# EAGLE design schematic (EAGLE 7.7.0)
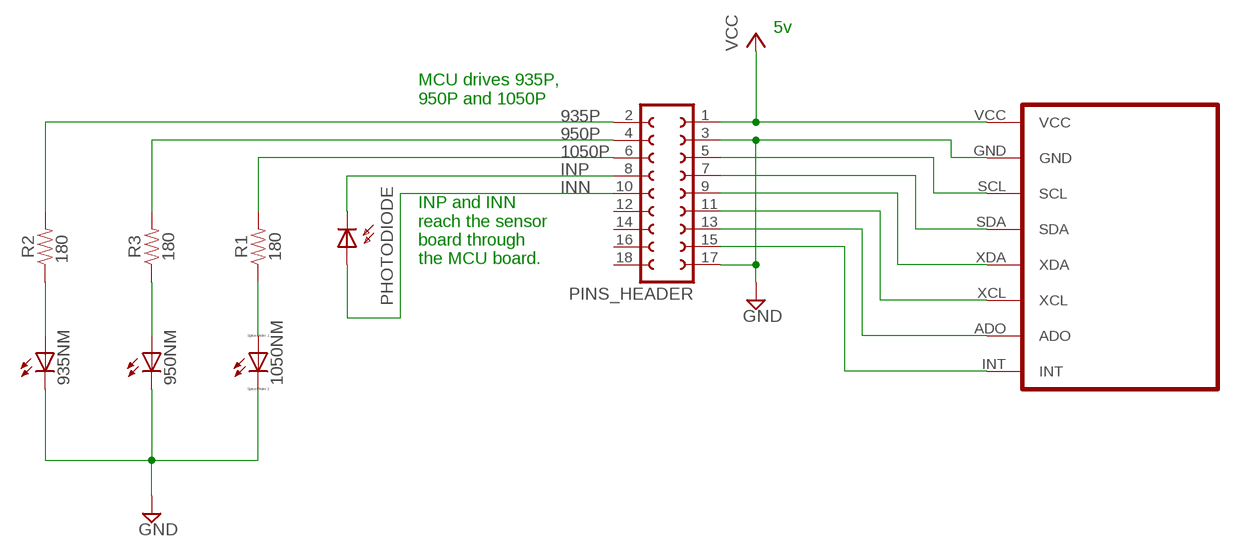
[diagram p0: schematic, sheet 1]

## Parts
935NM  LEDIRL80A  [IRL80A]
950NM  LEDIRL80A  [IRL80A]
1050NM  LED_E  [LED_1206]
PHOTODIODE  SFH206  [SFH206]
PINS_HEADER  FE09-2  [FE09-2]
R1  180  RESISTORAXIAL-0.3  [AXIAL-0.3]
R2  180  RESISTORAXIAL-0.3  [AXIAL-0.3]
R3  180  RESISTORAXIAL-0.3  [AXIAL-0.3]
U1  GY-521MPU6050  [GY-521]

## Nets
935P: PINS_HEADER.2 R2.P$2
950P: PINS_HEADER.4 R3.P$2
1050P: PINS_HEADER.6 R1.P$2
GND: 935NM.K(C) 950NM.K(C) 1050NM.C PINS_HEADER.3 PINS_HEADER.17 U1.GND
INN: PHOTODIODE.A PINS_HEADER.10
INP: PHOTODIODE.K(C) PINS_HEADER.8
N$1: 1050NM.A R1.P$1
N$2: 935NM.A R2.P$1
N$3: 950NM.A R3.P$1
N$6: PINS_HEADER.5 U1.SCL
N$7: PINS_HEADER.7 U1.SDA
N$8: PINS_HEADER.9 U1.XDA
N$9: PINS_HEADER.11 U1.XCL
N$10: PINS_HEADER.13 U1.ADO
N$11: PINS_HEADER.15 U1.INT
VCC: PINS_HEADER.1 U1.VCC
Unconnected: PINS_HEADER.12 PINS_HEADER.14 PINS_HEADER.16 PINS_HEADER.18

## Notes on the sheet
- 5v
- MCU drives 935P,
  950P and 1050P
- INP and INN
  reach the sensor
  board through 
  the MCU board.

## Library data of the parts
935NM 950NM = led:LED: LED OSRAM: - CHIPLED LG R971, LG N971, LY N971, LG Q971, LY Q971, LO R971, LY R971 LH N974, LH R974 LS Q976, LO Q976, LY Q976 LO Q996 - Hyper CHIPLED LW Q18S LB Q993, LB Q99A, LB R99A - SideLED LS A670, LO A670, LY A670, LG A670, LP A670 LB A673, LV A673, LT A673, LW A673 LH A674 LY A675 LS A676, LA A676, LO A676, LY A676, LW A676 LS A679, LY A679, LG A679 - Hyper Micro SIDELED® LS Y876, LA Y876, LO Y876, LY Y876 LT Y87S - SmartLED LW L88C, LW L88S LB L89C, LB L89S, LG L890 LS L89K, LO L89K, LY L89K LS L896, LA L896, LO L896, LY L896 - TOPLED LS T670, LO T670, LY T670, LG T670, LP T670 LSG T670, LSP T670, LSY T670, LOP T670, LYG T670 LG T671, LOG T671, LSG T671 LB T673, LV T673, LT T673, LW T673 LH T674 LS T676, LA T676, LO T676, LY T676, LB T676, LH T676, LSB T676, LW T676 LB T67C, LV T67C, LT T67C, LS T67K, LO T67K, LY T67K, LW E67C LS E67B, LA E67B, LO E67B, LY E67B, LB E67C, LV E67C, LT E67C LW T67C LS T679, LY T679, LG T679 LS T770, LO T770, LY T770, LG T770, LP T770 LB T773, LV T773, LT T773, LW T773 LH T774 LS E675, LA E675, LY E675, LS T675 LS T776, LA T776, LO T776, LY T776, LB T776 LHGB T686 LT T68C, LB T68C - Hyper Mini TOPLED® LB M676 - Mini TOPLED Santana® LG M470 LS M47K, LO M47K, LY M47K Source: http://www.osram.convergy.de LUXEON: - LUMILED® LXK2-PW12-R00, LXK2-PW12-S00, LXK2-PW14-U00, LXK2-PW14-V00 LXK2-PM12-R00, LXK2-PM12-S00, LXK2-PM14-U00 LXK2-PE12-Q00, LXK2-PE12-R00, LXK2-PE12-S00, LXK2-PE14-T00, LXK2-PE14-U00 LXK2-PB12-K00, LXK2-PB12-L00, LXK2-PB12-M00, LXK2-PB14-N00, LXK2-PB14-P00, LXK2-PB14-Q00 LXK2-PR12-L00, LXK2-PR12-M00, LXK2-PR14-Q00, LXK2-PR14-R00 LXK2-PD12-Q00, LXK2-PD12-R00, LXK2-PD12-S00 LXK2-PH12-R00, LXK2-PH12-S00 LXK2-PL12-P00, LXK2-PL12-Q00, LXK2-PL12-R00 Source: www.luxeon.com KINGBRIGHT: KA-3528ASYC Source: www.kingbright.com
1050NM = eagle-ltspice:LED_E: LED Source: http://www.osram.convergy.de Source: www.luxeon.com Source: www.kingbright.com; SPICEMODEL: NONE; SPICEPREFIX: D; SPICETYPE: diode
PHOTODIODE = opto-trans-siemens:SFH206: PHOTO DIODE; MPN: SFH206K; OC_FARNELL: 1212741; OC_NEWARK: 01M8807
PINS_HEADER = con-lsta:FE09-2: FEMALE HEADER; OC_FARNELL: unknown; OC_NEWARK: unknown
R1-R3 = SparkFun-Resistors:RESISTOR: Generic Resistor Package
U1 = gy-521:GY-521

## Board
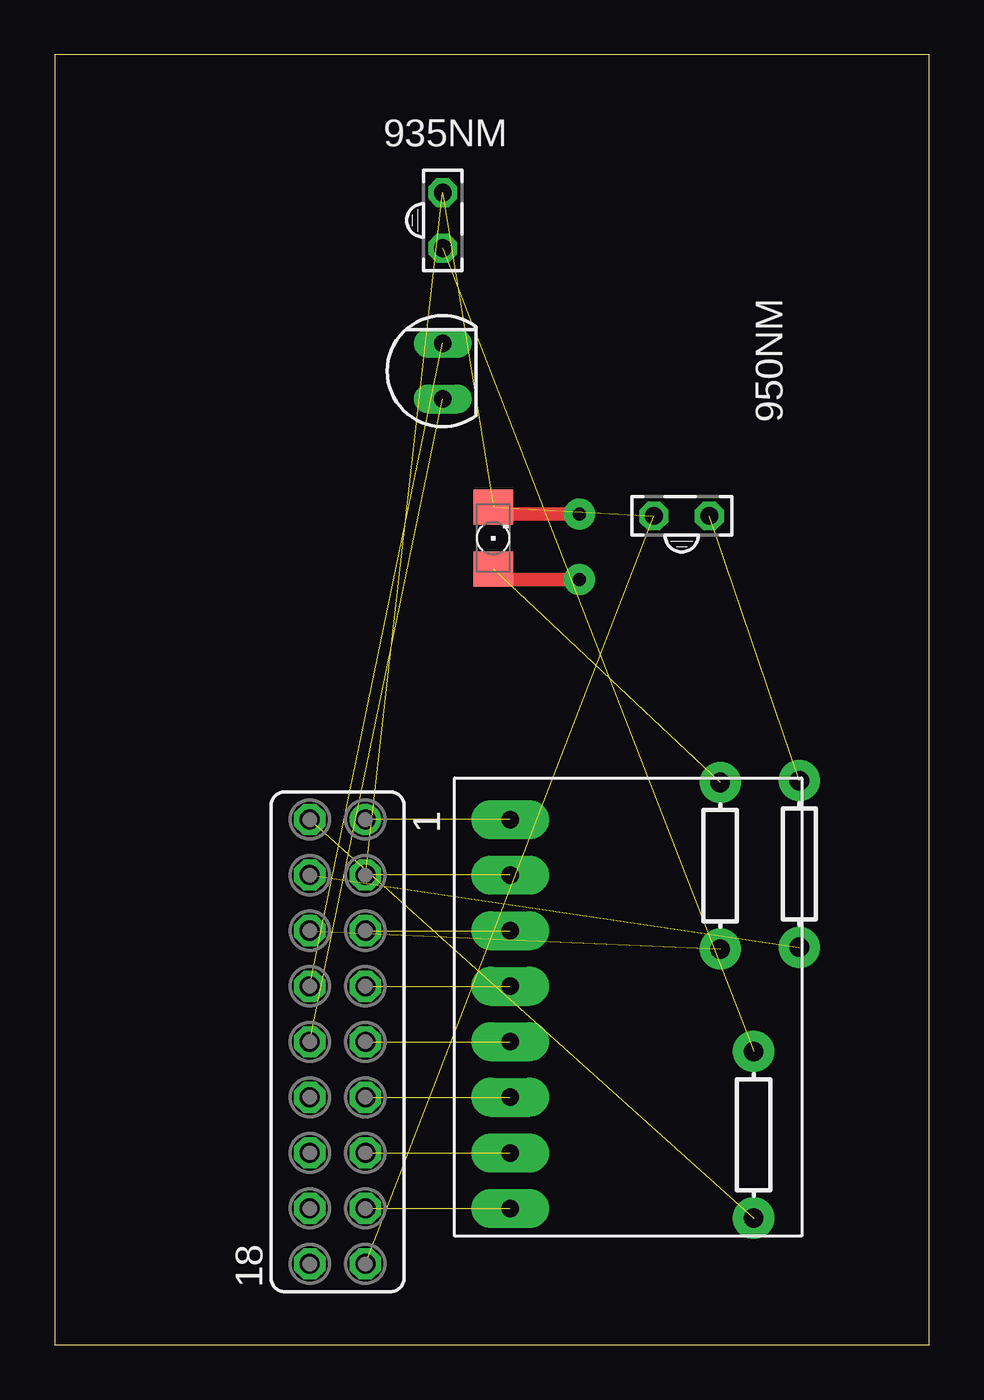
[diagram p1: board, top side]
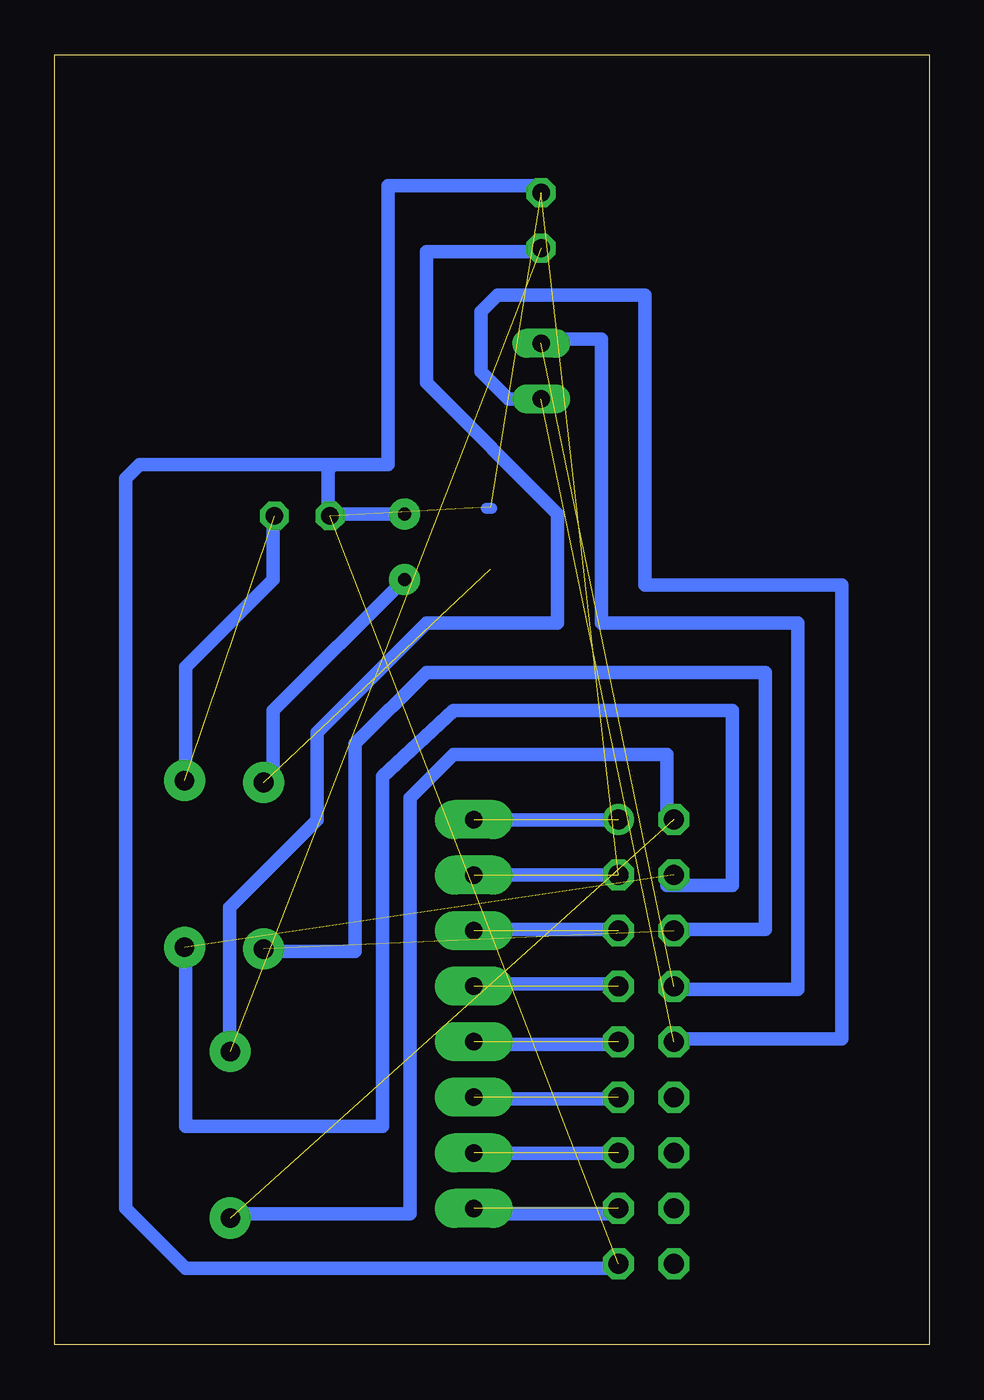
[diagram p2: board, bottom side, seen from below]

Size 40 x 59 mm. Coordinates in mm from the lower left corner, seen from the top.
Outline: 0,0 40,0 40,59 0,59 0,0
Copper layers (1*16): Top 0.035mm / dielectric 1.5mm / Bottom 0.035mm
Design rules "default": minimum track width 10mil, minimum drill 24mil, track to track 8mil, track to pad 8mil, pad to pad 8mil, via to via 8mil, smd to smd 8mil, copper to edge 40mil, drill to drill 8mil, minimum pad ring 10mil, minimum via ring 8mil, stop-mask expansion 4mil, vias tented up to drill 0mil, thermal gap 10mil

### Footprints (pad centres in the part's own frame; a part is rotated, then mirrored left to right if it is on the bottom)
IRL80A = drill 0.813 octagon: A 0,-1.27; K 0,1.27
LED_1206 = smd 1.6 x 1.803: A -1.422,0; C 1.422,0
SFH206 = drill 0.813 long: A 0,-1.27; K 0,1.27
FE09-2 = drill 0.914: 1 -10.16,1.27 | drill 0.914 octagon: 2 -10.16,-1.27; 3 -7.62,1.27; 4 -7.62,-1.27; 5 -5.08,1.27; 6 -5.08,-1.27; 7 -2.54,1.27; 8 -2.54,-1.27; 9 0,1.27; 10 0,-1.27; 11 2.54,1.27; 12 2.54,-1.27; 13 5.08,1.27; 14 5.08,-1.27; 15 7.62,1.27; 16 7.62,-1.27; 17 10.16,1.27; 18 10.16,-1.27
AXIAL-0.3 = drill 0.9 pad 1.88: P$1 -3.81,0; P$2 3.81,0
GY-521 = drill 0.8 pad 1.778 long: ADO -8.89,-6.35; GND -8.89,6.35; INT -8.89,-8.89; SCL -8.89,3.81; SDA -8.89,1.27; VCC -8.89,8.89; XCL -8.89,-3.81; XDA -8.89,-1.27

### Placement (x,y rotation side)
935NM  17.75,51.42 0 top
950NM  28.68,37.91 90 top
1050NM  20.06,36.89 90 top
PHOTODIODE  17.75,44.53 0 top
PINS_HEADER  12.94,13.86 270 top
R1  30.44,21.91 270 top
R2  31.97,9.61 270 top
R3  34.06,21.99 270 top
U1  29.72,15.13 0 top

### Tracks (layer width: path | path; a pad name or v marks a point on that pad's centre or on a via)
935P  (1 unrouted)
950P  (1 unrouted)
1050P  (1 unrouted)
GND  (5 unrouted)
INN  (1 unrouted)
INP  (1 unrouted)
N$1  (1 unrouted)
N$2  (1 unrouted)
N$3  (1 unrouted)
N$4
  Bottom 0.61: 14,24 20,24
N$5
  Bottom 0.61: 14.25,21.5 20,21.5
N$6  (1 unrouted)
N$7  (1 unrouted)
N$8  (1 unrouted)
N$9  (1 unrouted)
N$10  (1 unrouted)
N$11  (1 unrouted)
N$12
  Bottom 0.61: 14.25,19 20,19
N$13
  Bottom 0.61: 14,16.5 20,16.5
N$14
  Bottom 0.61: 14.25,13.75 20,13.75
N$15
  Bottom 0.61: 14.25,11.25 20,11.25
N$16
  Bottom 0.61: 14,8.75 20.25,8.75
N$17
  Bottom 0.61: 14.25,6 20.25,6
N$18
  Bottom 0.61: 17,46 15,46 15,33 6,33 6,16.25 11.5,16.25 11.75,16.5
N$19
  Bottom 0.61: 17.75,43.25 19.25,43.25 20.5,44.5 20.5,47.25 19.75,48 13,48 13,34.75 4,34.75 4,14 11.5,14
N$21
  Bottom 0.61: 18,50 23,50 23,48 23,44 17,38 17,33 23,33 28,28 28,24 32,20 32,13
N$23
  Bottom 0.61: 34,26 34,31 30,35 30,38
N$24  (via drill 0.6 pad 0.61, 0.6 pad 1.42)
  Top 0.61: v24,35 20,35
  Bottom 0.61: v24,35 30,29 30,26
N$25
  Bottom 0.61: 12,24 12,27 21.75,27 23.75,25 23.75,6 32,6
N$26
  Bottom 0.61: 11,19 7.5,19 7.5,30.75 23,30.75 26.25,27.5 26.25,18 30,18
N$27
  Bottom 0.61: 12,21 9,21 9,29 21.75,29 25,26 25,10 34,10 34,18
N$30
  Bottom 0.5: 20,38.25 20.25,38.25
N$32  (via drill 0.6 pad 0.61, 0.6 pad 1.42)
  Top 0.61: v24,38 20,38
  Bottom 0.5: 24.75,50.25 24.75,49.75
  Bottom 0.61: 27.25,40.25 24.75,40.25 24.75,49.75 24.75,53 18,53 | 27.25,40.25 27.5,40 27.5,38 v24,38 | 14.25,3.5 34,3.5 36.75,6.25 36.75,32.25 36.75,39.62 36.12,40.25 27.25,40.25
VCC  (1 unrouted)